# EAGLE design termosmart nodeMCU (EAGLE 8.4.3)
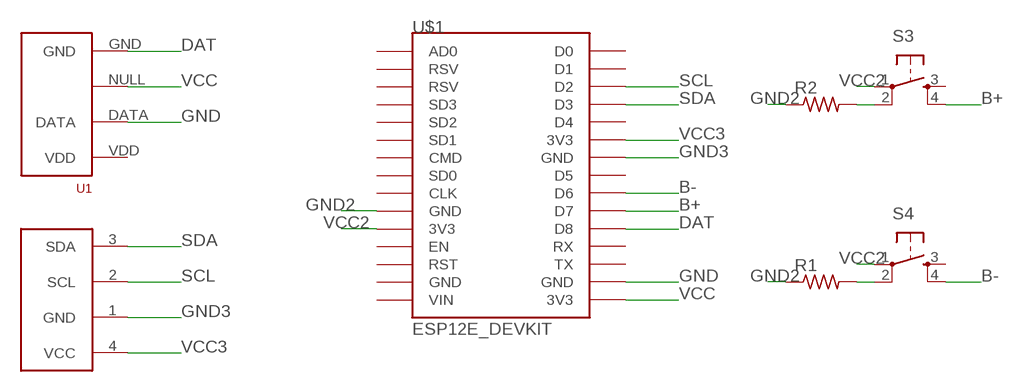
[diagram p0: schematic, sheet 1]

## Parts
R1  R-US_0204/5  [0204/5]
R2  R-US_0204/5  [0204/5]
S3  TAC_SWITCHPTH  [TACTILE-PTH]
S4  TAC_SWITCHPTH  [TACTILE-PTH]
U1  RHT03_DHT-22_AM2302  [RHT03_DHT-22]
U$1  ESP12E_DEVKIT  [ESP12E_DEVKIT]
U$3  I2C_OLED  [I2C_OLED_PACKAGE]

## Nets
B+: S3.4 U$1.D7
B-: S4.4 U$1.D6
DAT: U1.GND U$1.D8
GND: U1.DATA U$1.GND@3(GND)
GND2: R1.1 R2.1 U$1.GND@0(GND)
GND3: U$1.GND@2(GND) U$3.1(GND)
N$1: R2.2 S3.2
N$2: R1.2 S4.2
SCL: U$1.D2 U$3.2(SCL)
SDA: U$1.D3 U$3.3(SDA)
VCC: U1.NULL U$1.3V3@2(3V3)
VCC2: S3.1 S4.1 U$1.3V3@0(3V3)
VCC3: U$1.3V3@1(3V3) U$3.4(VCC)
Unconnected: S3.3 S4.3 U$1.AD0 U$1.CLK U$1.CMD U$1.D0 U$1.D1 U$1.D4 U$1.D5 U$1.EN U$1.GND@1(GND) U$1.RST U$1.RSV@0(RSV) U$1.RSV@1(RSV) U$1.RX U$1.SD0 U$1.SD1 U$1.SD2 U$1.SD3 U$1.TX U$1.VIN

## Power pins joined to a net without a drawn wire
VDD: U1.VDD

## Library data of the parts
R1 R2 = adafruit:R-US_: RESISTOR, American symbol
S3 S4 = SparkFun-Retired:TAC_SWITCH: Momentary Switch Button commonly used for reset or general input. Spark Fun Electronics SKU : COM-00097 SMT- SWCH-08247
U1 = RHT03_DHT-22_AM2302:RHT03_DHT-22_AM2302: RHT03 / DHT-22 / AM2302 Packages and symbol for the RHT03 / DHT-22 relative humidity and temperature sensor. Note: The AM2302 is a wired version of the DHT-22 which typically requires less clearance and is thus provided as a separate package.; PROD_ID: SEN-10167
U$1 = ESP12E_DEVKIT:ESP12E_DEVKIT: ESP12E DEVKIT BOARD
U$3 = DIYMall_OLED:I2C_OLED

## Board
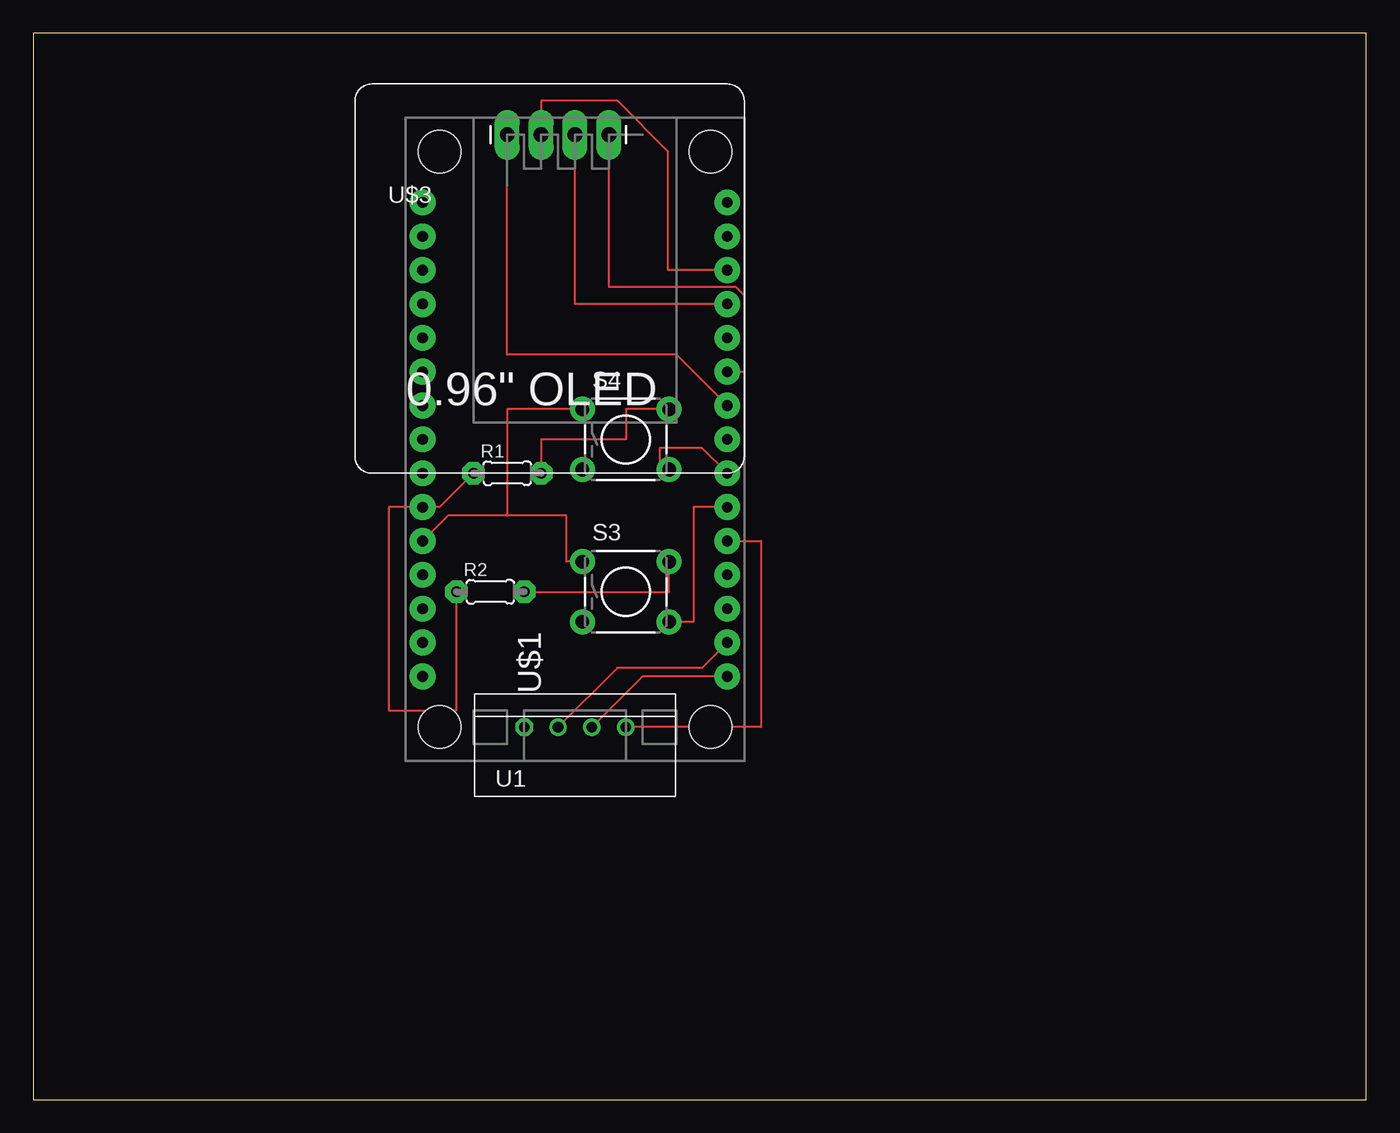
[diagram p1: board, top side]

Size 100 x 80 mm. Coordinates in mm from the lower left corner, seen from the top.
Outline: 0,0 100,0 100,80 0,80 0,0
Copper layers (1*16): Top 0.035mm / dielectric 1.5mm / Bottom 0.035mm
Design rules "default": minimum track width 6mil, minimum drill 0.35mm, track to track 6mil, track to pad 6mil, pad to pad 6mil, via to via 6mil, smd to smd 6mil, copper to edge 40mil, drill to drill 6mil, minimum pad ring 10mil, minimum via ring 8mil, stop-mask expansion 4mil, vias tented up to drill 0mil, thermal gap 10mil

### Footprints (pad centres in the part's own frame; a part is rotated, then mirrored left to right if it is on the bottom)
0204/5 = drill 0.813 pad 1.676 octagon: 1 -2.54,0; 2 2.54,0
TACTILE-PTH = drill 1.016 pad 1.88: 1 -3.251,2.261; 2 3.251,2.261; 3 -3.251,-2.261; 4 3.251,-2.261
RHT03_DHT-22 = drill 0.8: DATA -1.27,0; GND 3.81,0; NULL 1.27,0 | drill 0.8 octagon: VDD -3.81,0
ESP12E_DEVKIT = drill 0.8 pad 1.93: 3V3@0 -11.43,-7.62; 3V3@1 11.43,5.08; 3V3@2 11.43,-17.78; AD0 -11.43,17.78; CLK -11.43,-2.54; CMD -11.43,2.54; D0 11.43,17.78; D1 11.43,15.24; D2 11.43,12.7; D3 11.43,10.16; D4 11.43,7.62; D5 11.43,0; D6 11.43,-2.54; D7 11.43,-5.08; D8 11.43,-7.62; EN -11.43,-10.16; GND@0 -11.43,-5.08; GND@1 -11.43,-15.24; GND@2 11.43,2.54; GND@3 11.43,-15.24; RST -11.43,-12.7; RSV@0 -11.43,15.24; RSV@1 -11.43,12.7; RX 11.43,-10.16; SD0 -11.43,0; SD1 -11.43,5.08; SD2 -11.43,7.62; SD3 -11.43,10.16; TX 11.43,-12.7; VIN -11.43,-17.78 | hole 3.2: -10.16,21.59; 10.16,21.59; 10.16,-21.59; -10.16,-21.59
I2C_OLED_PACKAGE = drill 1.118 pad 1.88 long: 1 0,0; 2 2.54,0; 3 5.08,0; 4 7.62,0

### Placement (x,y rotation side)
R1  35.56,46.99 0 top
R2  34.29,38.1 0 top
S3  44.45,38.1 0 top
S4  44.45,49.53 0 top
U1  40.64,27.94 0 top
U$1  40.64,49.53 0 top
U$3  35.56,72.39 0 top

### Tracks (layer width: path | path; a pad name or v marks a point on that pad's centre or on a via)
B+
  Top 0.152: U$1.D7 49.53,44.45 49.53,35.84 S3.4
B-
  Top 0.152: U$1.D6 50.16,48.9 46.99,48.9 46.99,47.27 S4.4
DAT
  Top 0.152: U$1.D8 54.61,41.91 54.61,27.94 U1.GND
GND
  Top 0.152: U1.DATA 43.81,32.38 50.16,32.38 U$1.GND@3
GND2
  Top 0.152: R1.1 30.48,44.45 U$1.GND@0 26.67,44.45 26.67,29.21 31.75,29.21 R2.1
GND3
  Top 0.152: U$3.1 35.56,55.88 48.26,55.88 U$1.GND@2
N$1
  Top 0.152: R2.2 47.7,38.1 S3.2
N$2
  Top 0.152: S4.2 44.45,51.79 44.45,49.53 38.1,49.53 R1.2
SCL
  Top 0.152: U$3.2 38.1,74.93 43.81,74.93 47.62,71.12 47.62,62.23 U$1.D2
SDA
  Top 0.152: U$3.3 40.64,59.69 U$1.D3
VCC
  Top 0.152: U1.NULL 45.72,31.75 U$1.3V3@2
VCC2
  Top 0.152: 35.56,43.81 31.11,43.81 U$1.3V3@0 | 35.56,43.81 40.01,43.81 40.01,40.36 S3.1 | S4.1 35.56,51.79 35.56,43.81
VCC3
  Top 0.152: U$3.4 43.18,60.96 52.7,60.96 53.34,60.33 53.34,54.61 U$1.3V3@1